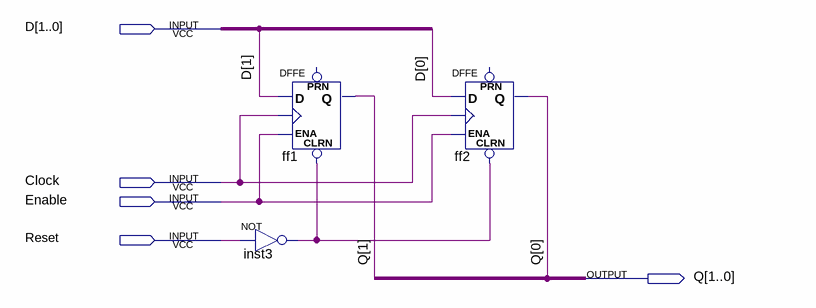
[diagram p0: schematic sheet]
// Quartus schematic register2.bdf as structural Verilog: 3 symbols, 5 pins
module register2 (
  input  [1:0] D,
  input  Clock,
  input  Enable,
  input  Reset,
  output [1:0] Q
);

  wire inst3_out;

  not inst3 (inst3_out, Reset);
  DFFE ff1 (.CLRN(inst3_out), .D(D[1]), .CLK(Clock), .ENA(Enable), .Q(Q[1]));  // open: PRN
  DFFE ff2 (.CLRN(inst3_out), .D(D[0]), .CLK(Clock), .ENA(Enable), .Q(Q[0]));  // open: PRN
endmodule
